# Altium schematic sheet 04-CPU_BOARD.SchDoc
size B
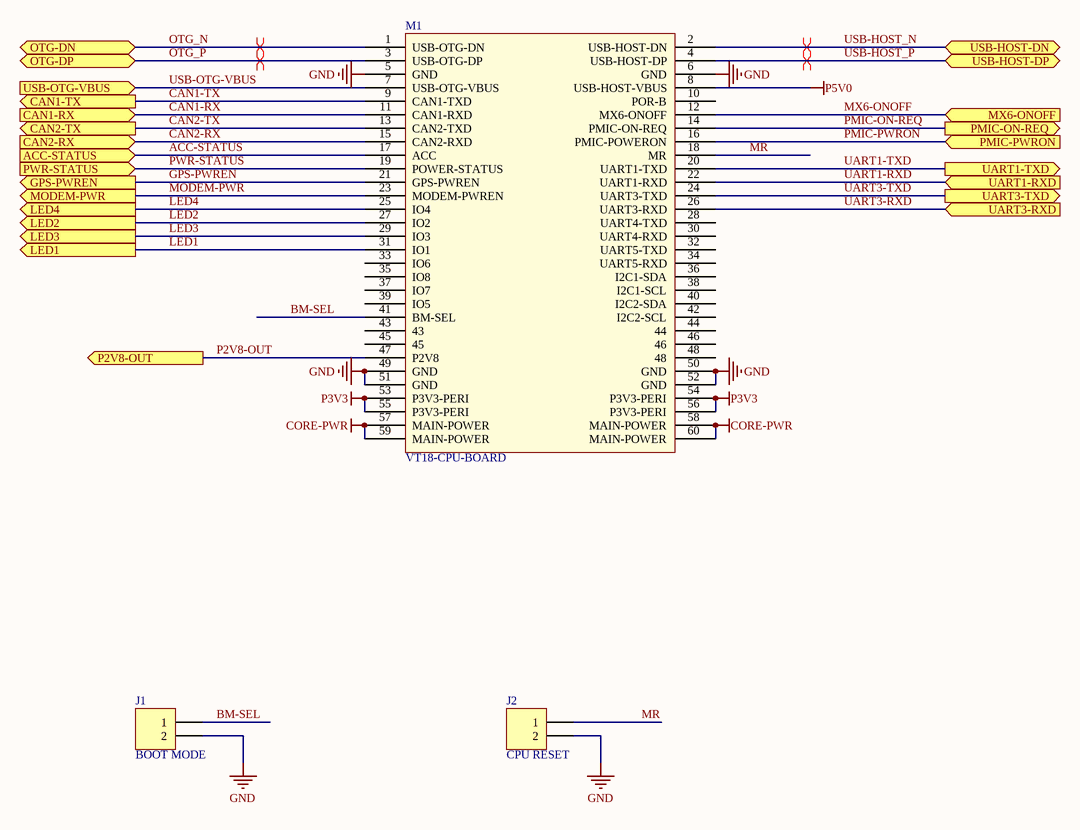
[diagram p0: 04-CPU_BOARD.SchDoc]

## Parts
J1  BOOT MODE  [HDR1X2]
J2  CPU RESET  [HDR1X2]
M1  VT18-CPU-BOARD  [VT18-CPU-BOARD]

## Ports
ACC-STATUS (in), CAN1-RX (in), CAN1-TX (out), CAN2-RX (in), CAN2-TX (out), GPS-PWREN (out), LED1 (out), LED2 (out), LED3 (out), LED4 (out), MODEM-PWR (out), MX6-ONOFF (in), OTG-DN, OTG-DP (bidir), P2V8-OUT (out), PMIC-ON-REQ (out), PMIC-PWRON (in), PWR-STATUS (in), UART1-RXD (in), UART1-TXD (out), UART3-RXD (in), UART3-TXD (out), USB-HOST-DN (bidir), USB-HOST-DP (bidir), USB-OTG-VBUS (in)

## Nets
CORE-PWR: M1.57(MAIN-POWER) M1.58(MAIN-POWER) M1.59(MAIN-POWER) M1.60(MAIN-POWER)
GND: J1.2 J2.2 M1.5(GND) M1.6(GND) M1.49(GND) M1.50(GND) M1.51(GND) M1.52(GND)
P3V3: M1.53(P3V3-PERI) M1.54(P3V3-PERI) M1.55(P3V3-PERI) M1.56(P3V3-PERI)
P5V0: M1.8(USB-HOST-VBUS)
ACC-STATUS: M1.17(ACC) ; port ACC-STATUS
BM-SEL: J1.1 M1.41(BM-SEL)
CAN1-RX: M1.11(CAN1-RXD) ; port CAN1-RX
CAN1-TX: M1.9(CAN1-TXD) ; port CAN1-TX
CAN2-RX: M1.15(CAN2-RXD) ; port CAN2-RX
CAN2-TX: M1.13(CAN2-TXD) ; port CAN2-TX
GPS-PWREN: M1.21(GPS-PWREN) ; port GPS-PWREN
LED1: M1.31(IO1) ; port LED1
LED2: M1.27(IO2) ; port LED2
LED3: M1.29(IO3) ; port LED3
LED4: M1.25(IO4) ; port LED4
MODEM-PWR: M1.23(MODEM-PWREN) ; port MODEM-PWR
MR: J2.1 M1.18(MR)
MX6-ONOFF: M1.12(MX6-ONOFF) ; port MX6-ONOFF
OTG_N: M1.1(USB-OTG-DN) ; port OTG-DN
OTG_P: M1.3(USB-OTG-DP) ; port OTG-DP
P2V8-OUT: M1.47(P2V8) ; port P2V8-OUT
PMIC-ON-REQ: M1.14(PMIC-ON-REQ) ; port PMIC-ON-REQ
PMIC-PWRON: M1.16(PMIC-POWERON) ; port PMIC-PWRON
PWR-STATUS: M1.19(POWER-STATUS) ; port PWR-STATUS
UART1-RXD: M1.22(UART1-RXD) ; port UART1-RXD
UART1-TXD: M1.20(UART1-TXD) ; port UART1-TXD
UART3-RXD: M1.26(UART3-RXD) ; port UART3-RXD
UART3-TXD: M1.24(UART3-TXD) ; port UART3-TXD
USB-HOST_N: M1.2(USB-HOST-DN) ; port USB-HOST-DN
USB-HOST_P: M1.4(USB-HOST-DP) ; port USB-HOST-DP
USB-OTG-VBUS: M1.7(USB-OTG-VBUS) ; port USB-OTG-VBUS

Not connected (* = marked no-connect by the designer): M1 10(POR-B) 28(UART4-TXD) 30(UART4-RXD) 32(UART5-TXD) 33(IO6) 34(UART5-RXD) 35(IO8) 36(I2C1-SDA) 37(IO7) 38(I2C1-SCL) 39(IO5) 40(I2C2-SDA) 42(I2C2-SCL) 43 44 45 46 48

## Layout directives
differential pair: OTG_N, OTG_P, USB-HOST_N, USB-HOST_P

## Library data of the parts
J1 J2 = Header 2: Header, 2-Pin; LatestRevisionDate: 17-Jul-2002; LatestRevisionNote: Re-released for DXP Platform.; Publisher: Altium Limited